# EAGLE design ttl_net_fast_and (EAGLE 6.6.0)
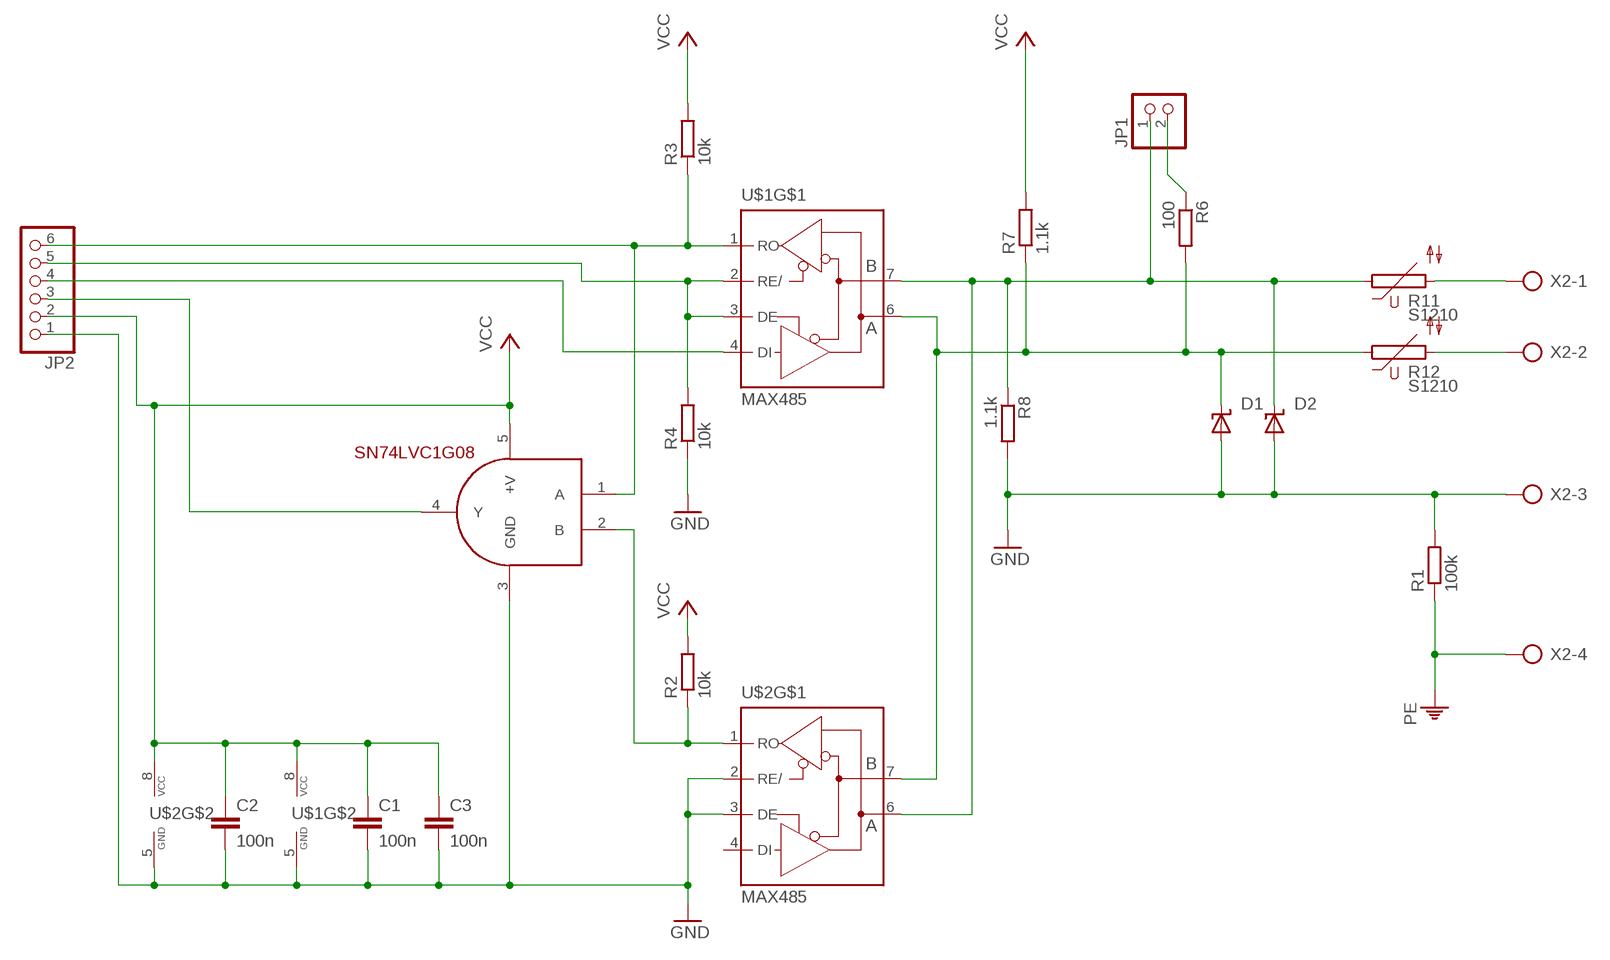
[diagram p0: schematic, sheet 1]

## Parts
C1  100n  C-EU050-035X075  [C050-035X075]
C2  100n  C-EU050-035X075  [C050-035X075]
C3  100n  C-EUC1206  [C1206]
D1  SUPPRESSOR-SMBJ  [SMBJ]
D2  SUPPRESSOR-SMBJ  [SMBJ]
JP1  PINHD-1X2  [1X02]
JP2  PINHD-1X6  [1X06]
R1  100k  R-EU_0204/7  [0204/7]
R2  10k  R-EU_R1206  [R1206]
R3  10k  R-EU_R1206  [R1206]
R4  10k  R-EU_R1206  [R1206]
R6  100  R-EU_0204/7  [0204/7]
R7  1.1k  R-EU_0204/7  [0204/7]
R8  1.1k  R-EU_0204/7  [0204/7]
R11  S1210  [S1210]
R12  S1210  [S1210]
U$1  MAX485  [DIL08]
U$2  MAX485  [DIL08]
U$3  SN74LVC1G08  [SOT23-5]
X2  AK500/4  [AK500/4]

## Nets
GND: C1.2 C2.2 C3.2 D1.A D2.A JP2.1 R1.2 R4.1 R8.2 U$1.5(GND) U$2.2(RE/) U$2.3(DE) U$2.5(GND) U$3.3(GND) X2.3
N$2: D1.C R6.2 R7.1 R12.1 U$1.6(A) U$2.7(B)
N$3: R2.1 U$2.1(RO) U$3.2(B)
N$4: JP2.4 U$1.4(DI)
N$5: JP2.3 U$3.4(Y)
N$6: JP2.6 R3.1 U$1.1(RO) U$3.1(A)
N$7: JP2.5 R4.2 U$1.2(RE/) U$1.3(DE)
N$8: JP1.2 R6.1
N$9: R11.2 X2.1
N$10: D2.C JP1.1 R8.1 R11.1 U$1.7(B) U$2.6(A)
N$11: R12.2 X2.2
PE: R1.1 X2.4
VCC: C1.1 C2.1 C3.1 JP2.2 R2.2 R3.2 R7.2 U$1.8(VCC) U$2.8(VCC) U$3.5(+V)
Unconnected: U$2.4(DI)

## Library data of the parts
C1-C3 = rcl:C-EU: CAPACITOR, European symbol
D1 D2 = diode:SUPPRESSOR-: Suppressor diode
JP1 = pinhead:PINHD-1X2: PIN HEADER
JP2 = pinhead:PINHD-1X6: PIN HEADER
R1 R6-R8 = resistor:R-EU_: RESISTOR, European symbol
R2-R4 = rcl:R-EU_: RESISTOR, European symbol
R11 R12 = varistor:S1210: VARISTOR
U$1 U$2 = maxim:MAX485
U$3 = SparkFun:SN74LVC1G08
X2 = con-ptr500:AK500/4: CONNECTOR; OC_FARNELL: unknown; OC_NEWARK: unknown

## Board
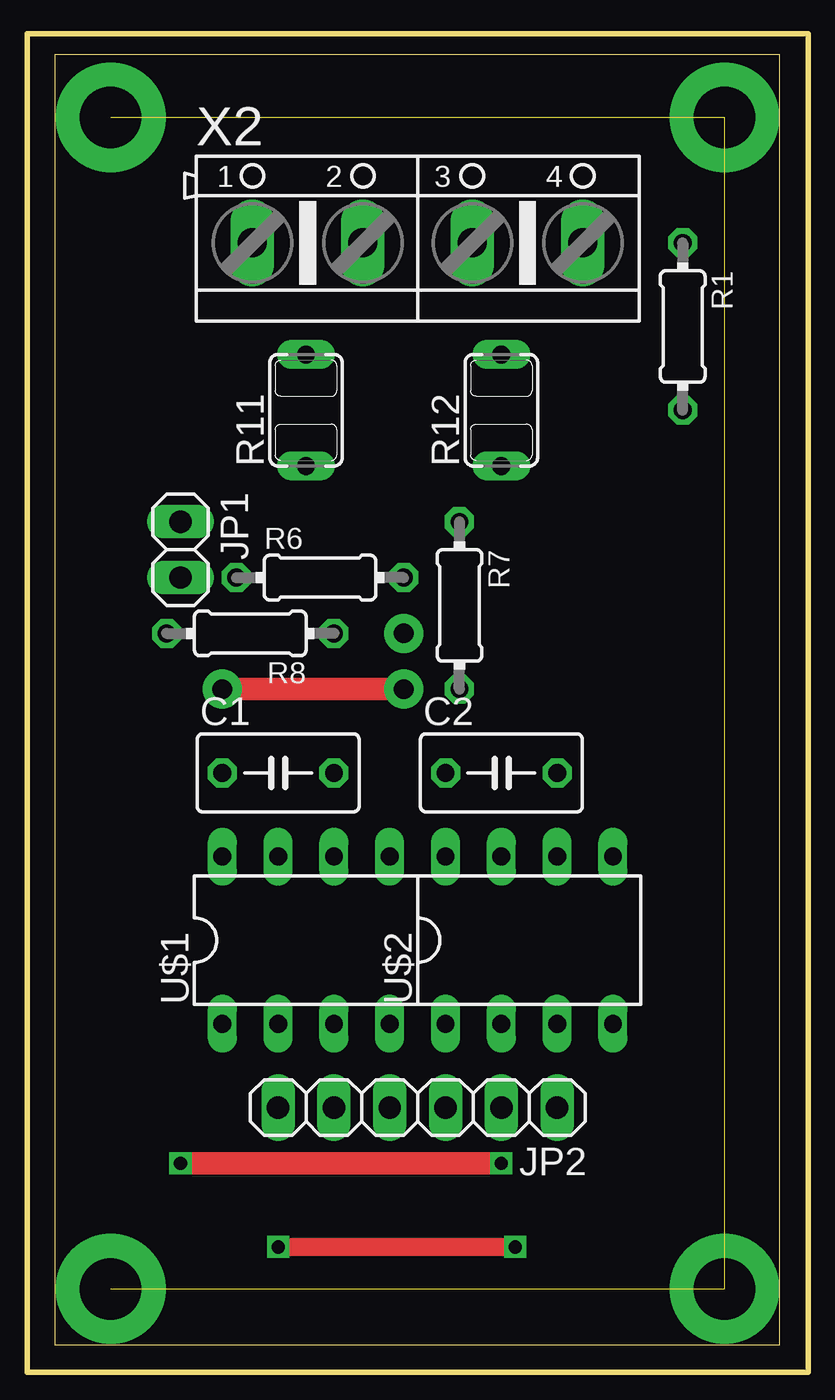
[diagram p1: board, top side]
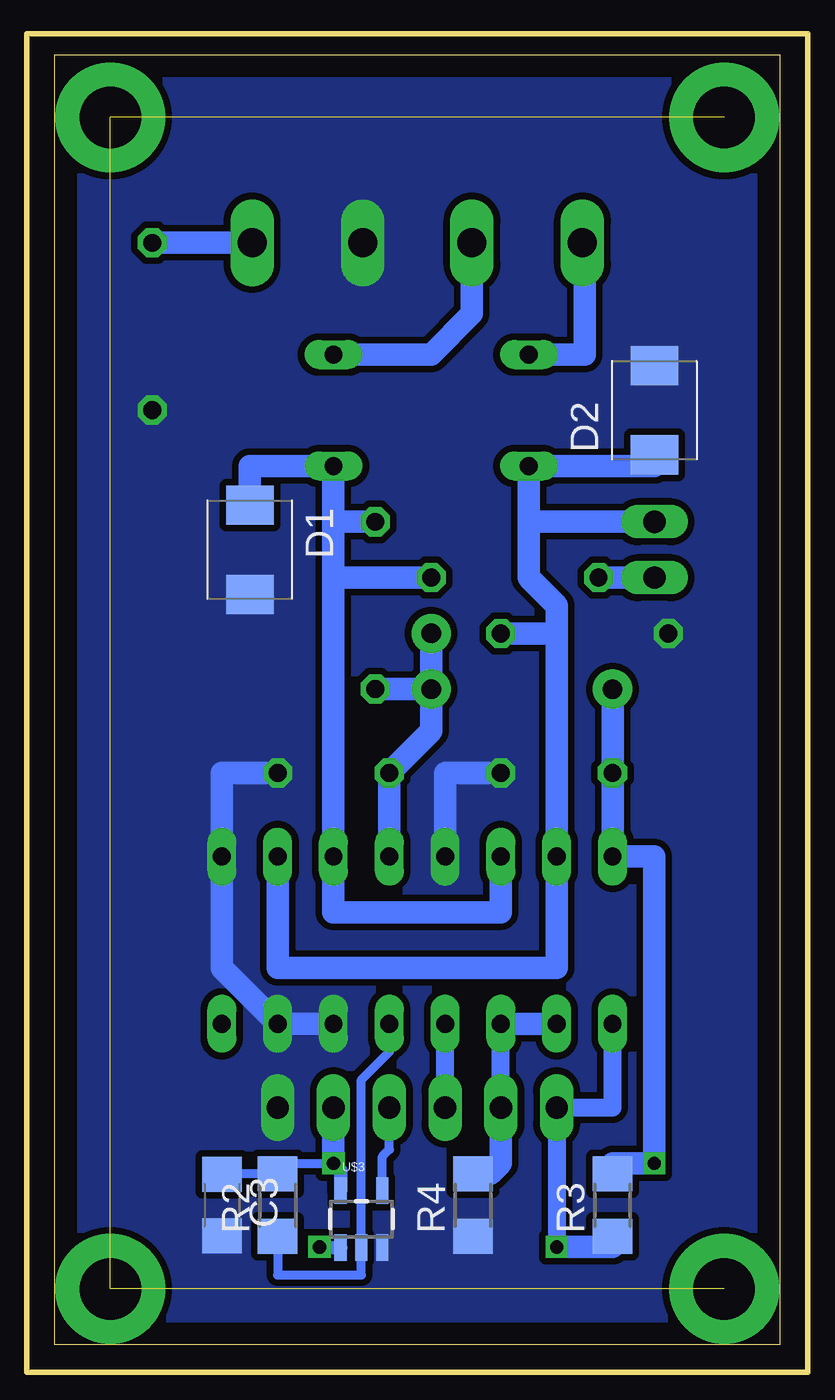
[diagram p2: board, bottom side, seen from below]

Size 33 x 58.72 mm. Coordinates in mm from the lower left corner, seen from the top.
Outline: 0,0 33,0 33,58.72 0,58.72 0,0
Copper layers (1*16): Top 0.035mm / dielectric 1.5mm / Bottom 0.035mm
Design rules "default": minimum track width 10mil, minimum drill 24mil, track to track 8mil, track to pad 8mil, pad to pad 8mil, via to via 8mil, smd to smd 8mil, copper to edge 40mil, drill to drill 8mil, minimum pad ring 10mil, minimum via ring 8mil, stop-mask expansion 4mil, vias tented up to drill 0mil, thermal gap 10mil
Milling: 4 lines

### Footprints (pad centres in the part's own frame; a part is rotated, then mirrored left to right if it is on the bottom)
C050-035X075 = drill 0.813 octagon: 1 -2.54,0; 2 2.54,0
C1206 = smd 1.6 x 1.8: 1 -1.4,0; 2 1.4,0
SMBJ = smd 1.78 x 2.16: A 2.04,0; C -2.03,0
1X02 = drill 1.016 long: 1 -1.27,0; 2 1.27,0
1X06 = drill 1.016 long: 1 -6.35,0; 2 -3.81,0; 3 -1.27,0; 4 1.27,0; 5 3.81,0; 6 6.35,0
0204/7 = drill 0.813 octagon: 1 -3.81,0; 2 3.81,0
R1206 = smd 1.6 x 1.803: 1 -1.422,0; 2 1.422,0
S1210 = drill 0.813 long: 1 -2.54,0; 2 2.54,0
DIL08 = drill 0.813 long: 1 -3.81,-3.81; 2 -1.27,-3.81; 3 1.27,-3.81; 4 3.81,-3.81; 5 3.81,3.81; 6 1.27,3.81; 7 -1.27,3.81; 8 -3.81,3.81
SOT23-5 = smd 0.55 x 1.2: 1 -0.95,-1.3; 2 0,-1.3; 3 0.95,-1.3; 4 0.95,1.3; 5 -0.95,1.3
AK500/4 = drill 1.321 long: 1 -7.518,0; 2 -2.489,0; 3 2.489,0; 4 7.518,0

### Placement (x,y rotation side)
C1  10.16,26.04 0 top
C2  20.32,26.04 0 top
C3  25.4,6.35 270 bottom
D1  24.13,36.2 270 bottom
D2  5.71,42.54 90 bottom
JP1  5.71,36.2 270 top
JP2  16.51,10.79 180 top
R1  28.57,46.35 270 top
R2  22.86,6.35 90 bottom
R3  7.62,6.35 90 bottom
R4  13.97,6.35 90 bottom
R6  12.07,34.92 0 top
R7  18.41,33.65 270 top
R8  8.89,32.38 180 top
R11  11.43,42.54 90 top
R12  20.32,42.54 90 top
U$1  11.43,18.41 0 top
U$2  21.59,18.41 0 top
U$3  19.05,5.71 0 bottom
X2  16.51,50.16 0 top

### Tracks (layer width: path | path; a pad name or v marks a point on that pad's centre or on a via)
GND
  Bottom 1.016: 19.05,50.11 X2.3 | U$1.5 15.24,26.04 C1.2 | C2.2 25.4,26.04 U$2.5 25.4,17.14 U$2.3 U$2.2
  pour Bottom (isolate 0.305, no thermals): 0,59.05 0,0 33.02,0 33.02,59.05
N$2
  Bottom 1.016: U$1.6 12.7,19.68 20.32,19.68 U$2.7 20.32,34.92 | 20.32,34.92 20.32,37.46 | 20.32,37.46 R12.1 24.13,40 D1.C | R6.2 20.32,34.92 | R7.1 20.32,37.46
N$3
  Bottom 0.406: U$2.1 17.78,13.34 19.05,12.07 U$3.2 19.05,3.18 22.86,3.18 R2.1
N$4
  Bottom 0.813: JP2.4 U$1.4
N$5
  Bottom 0.406: U$3.4 18.1,8.57 17.78,8.89 JP2.3
N$6  (via drill 0.6)
  Top 0.813: v10.16,4.45 v20.96,4.45
  Bottom 0.61: U$3.1 20.29,4.41 v20.96,4.45
  Bottom 0.813: U$1.1 7.62,10.79 JP2.6 v10.16,4.45
  Bottom 1.016: R3.1 7.62,4.45 v10.16,4.45
N$7
  Bottom 0.406: 12.55,10.64 JP2.5
  Bottom 0.813: JP2.5 U$1.3
  Bottom 1.016: U$1.3 U$1.2 | R4.2 13.18,7.77 12.7,8.26 JP2.5
N$8
  Bottom 1.016: R6.1 JP1.2
N$9
  Bottom 1.016: 8.89,50.16 X2.1 8.89,50.06 8.89,45.08 R11.2
N$10
  Bottom 1.016: 10.16,32.38 U$1.7 10.16,17.14 22.86,17.14 U$2.6 | 10.16,32.38 10.16,33.65 11.43,34.92 11.43,37.46 | 11.43,37.46 R11.1 5.71,40 D2.C | R8.1 10.16,32.38 | JP1.1 11.43,37.46
N$11
  Bottom 1.016: X2.2 14.02,46.94 15.88,45.08 R12.2
N$12  (via drill 2.8 pad 5)  (3 unrouted)
  other vias: 2.54,2.54 2.54,55.88 30.48,55.88 30.48,2.54
PE
  Bottom 1.016: R1.1 24.77,50.16 24.13,50.06 X2.4
VCC  (via drill 0.6, 0.9 pad 1.78)
  Top 1.016: v15.88,29.84 v7.62,29.84 | v20.32,8.26 v5.71,8.26
  Bottom 0.406: v20.32,8.26 22.86,8.26 R2.2 25.4,7.77 C3.1
  Bottom 0.61: U$3.5 20,7.94 v20.32,8.26
  Bottom 1.016: v7.62,29.84 C1.1 U$1.8 5.71,22.23 v5.71,8.26 7.62,8.26 R3.2 | v15.88,29.84 15.88,27.94 C2.1 U$2.8 | JP2.2 v20.32,8.26 | v15.88,29.84 v15.88,32.38 | R7.2 v15.88,29.84